# Altium schematic sheet STM32H730_PINOUT.SchDoc
size D; SheetNumber: 5; SheetTotal: 6
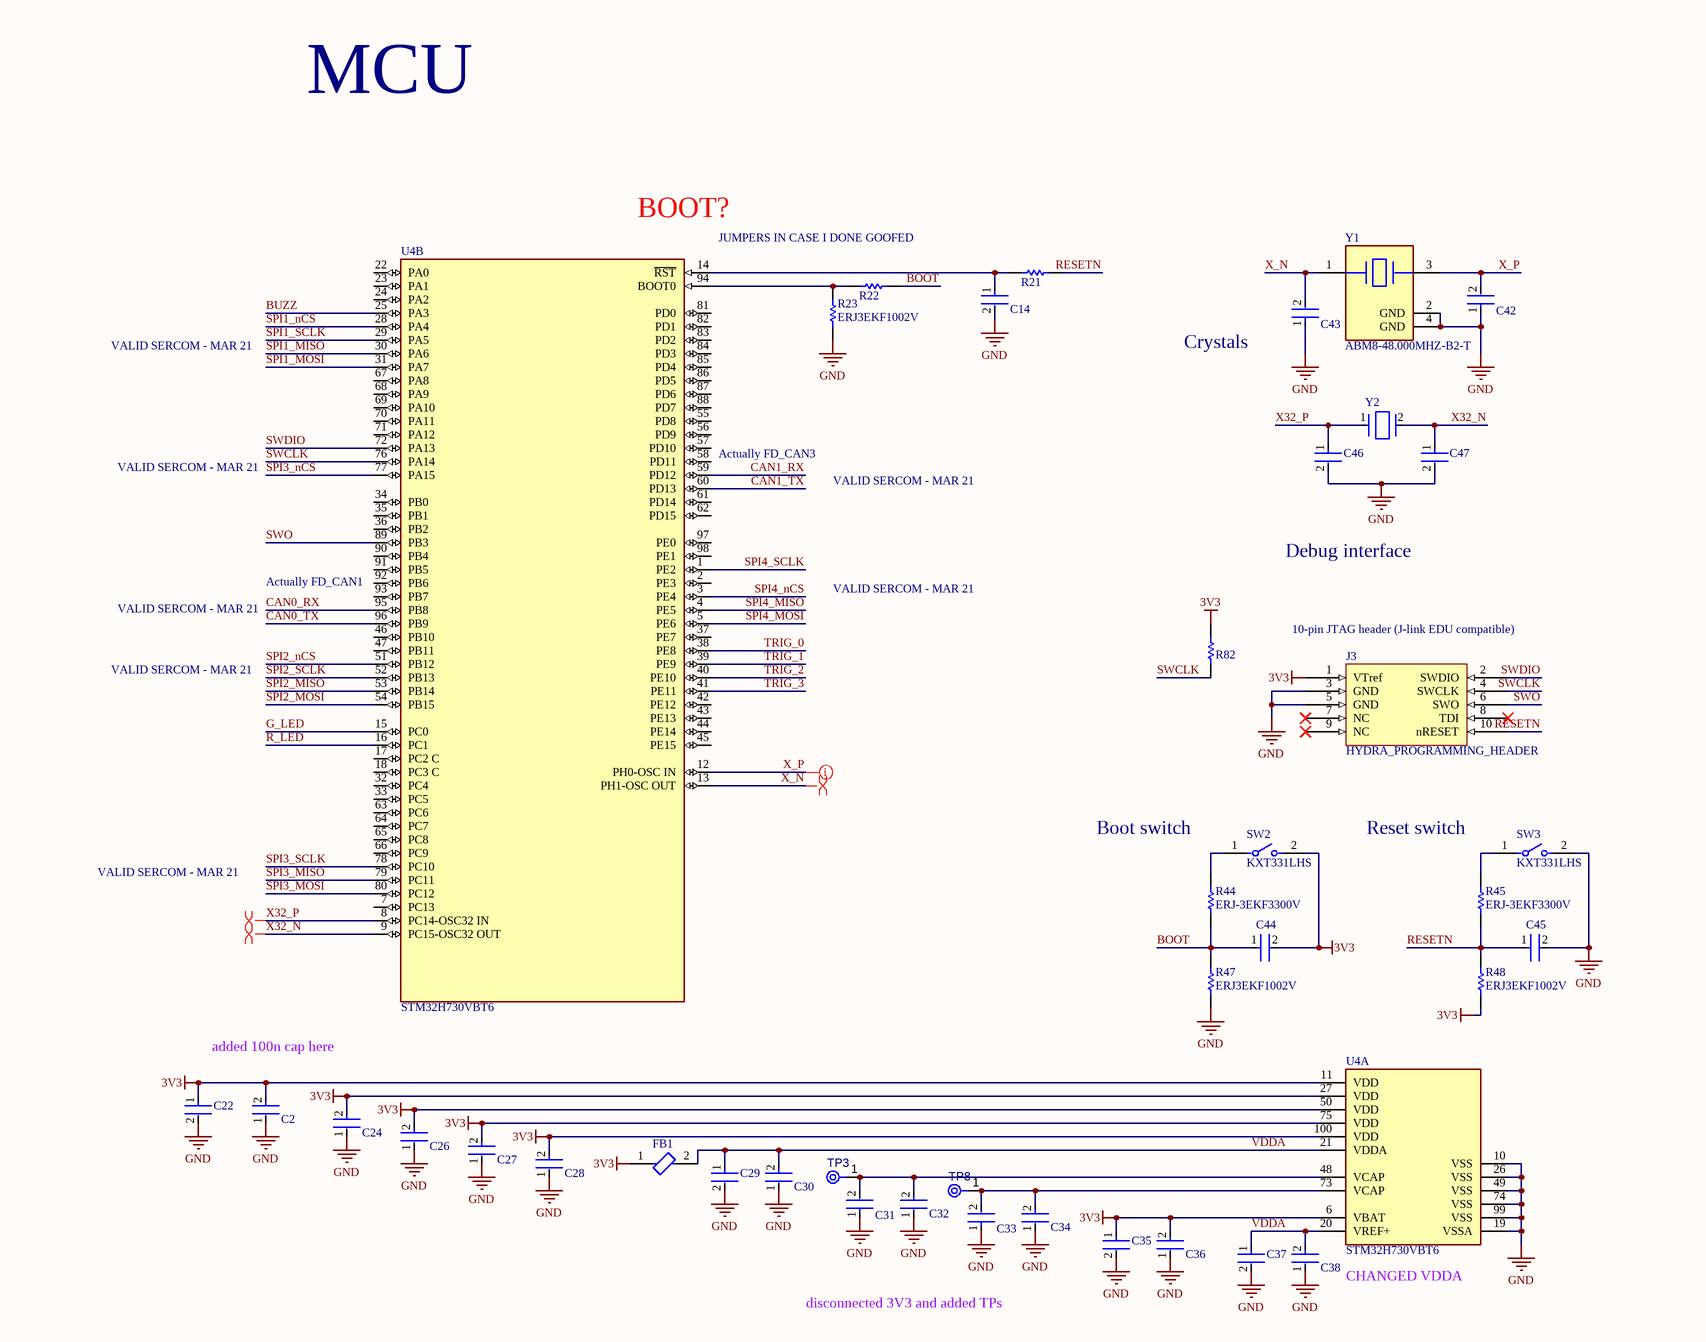
[diagram p0: STM32H730_PINOUT.SchDoc, top left]
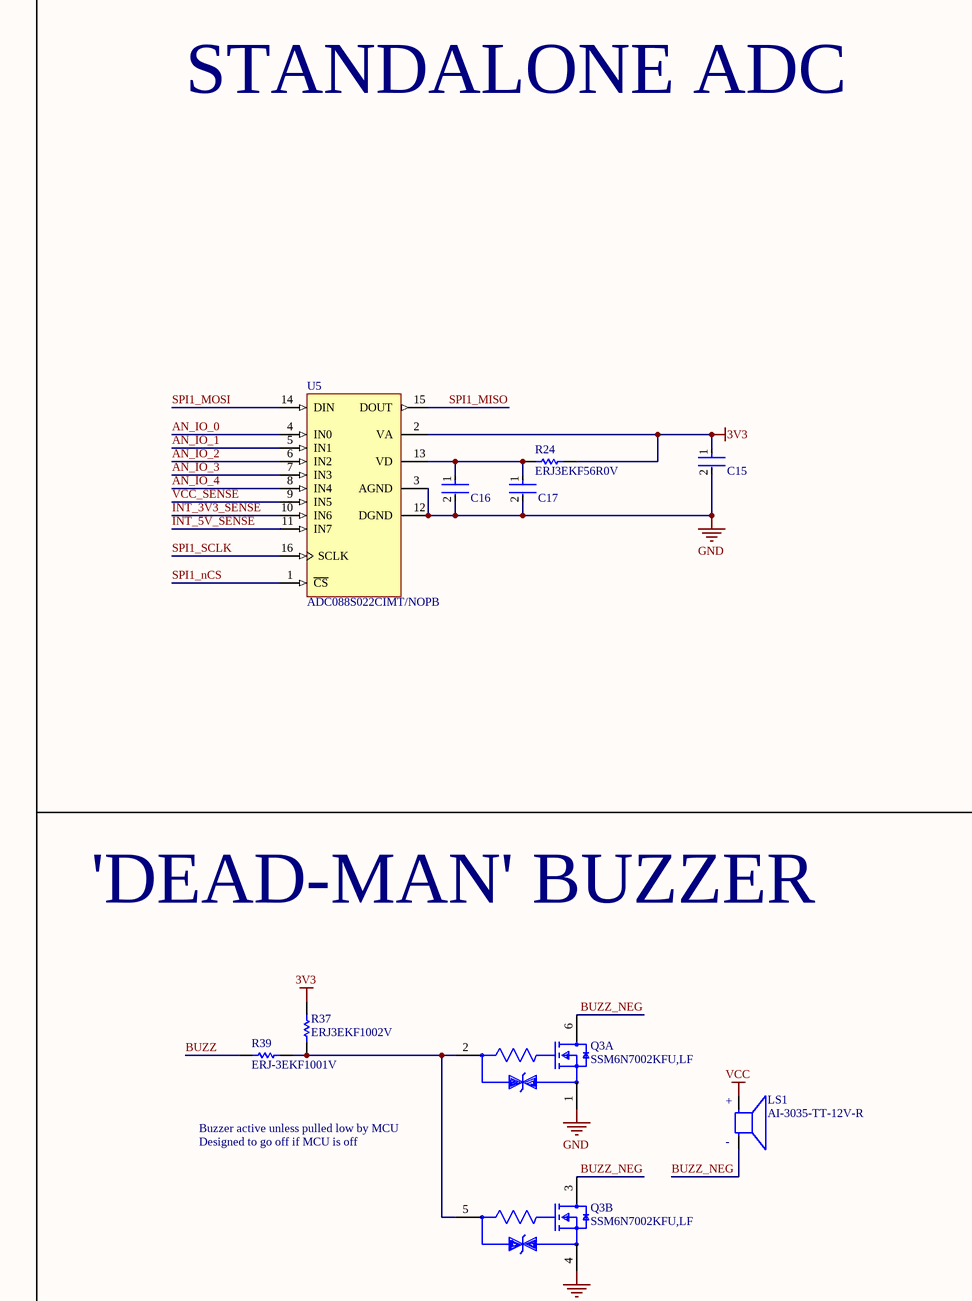
[diagram p1: STM32H730_PINOUT.SchDoc, top middle]
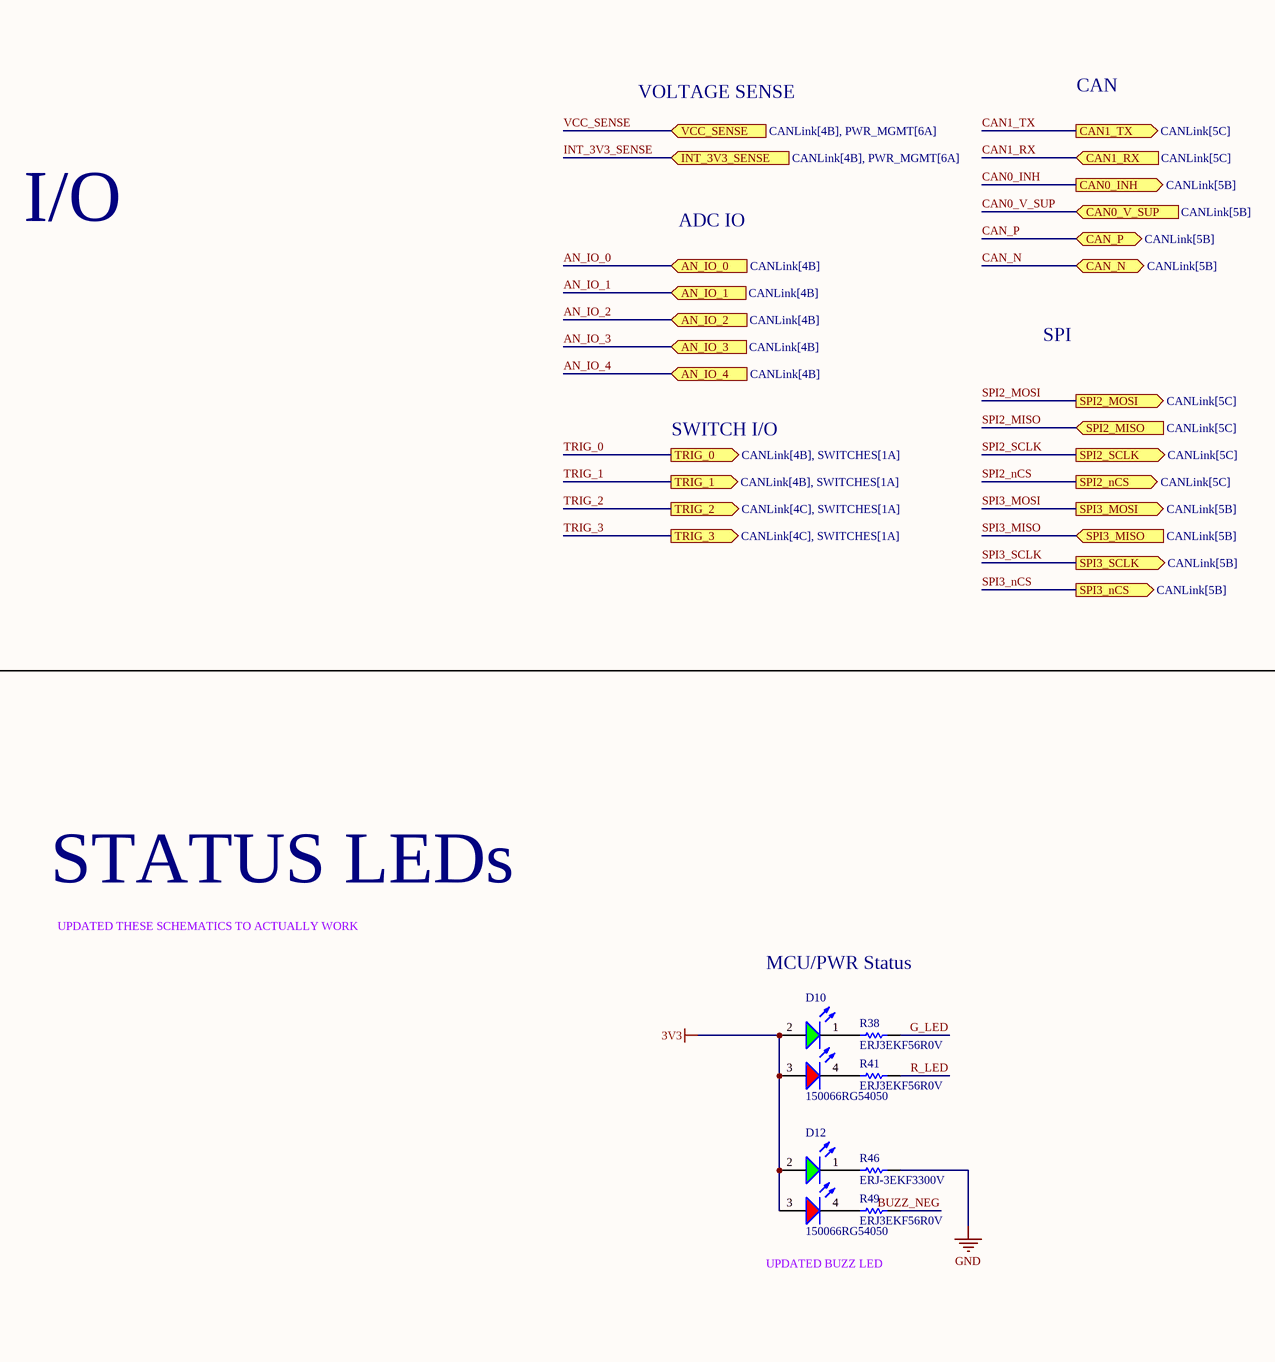
[diagram p2: STM32H730_PINOUT.SchDoc, top right]
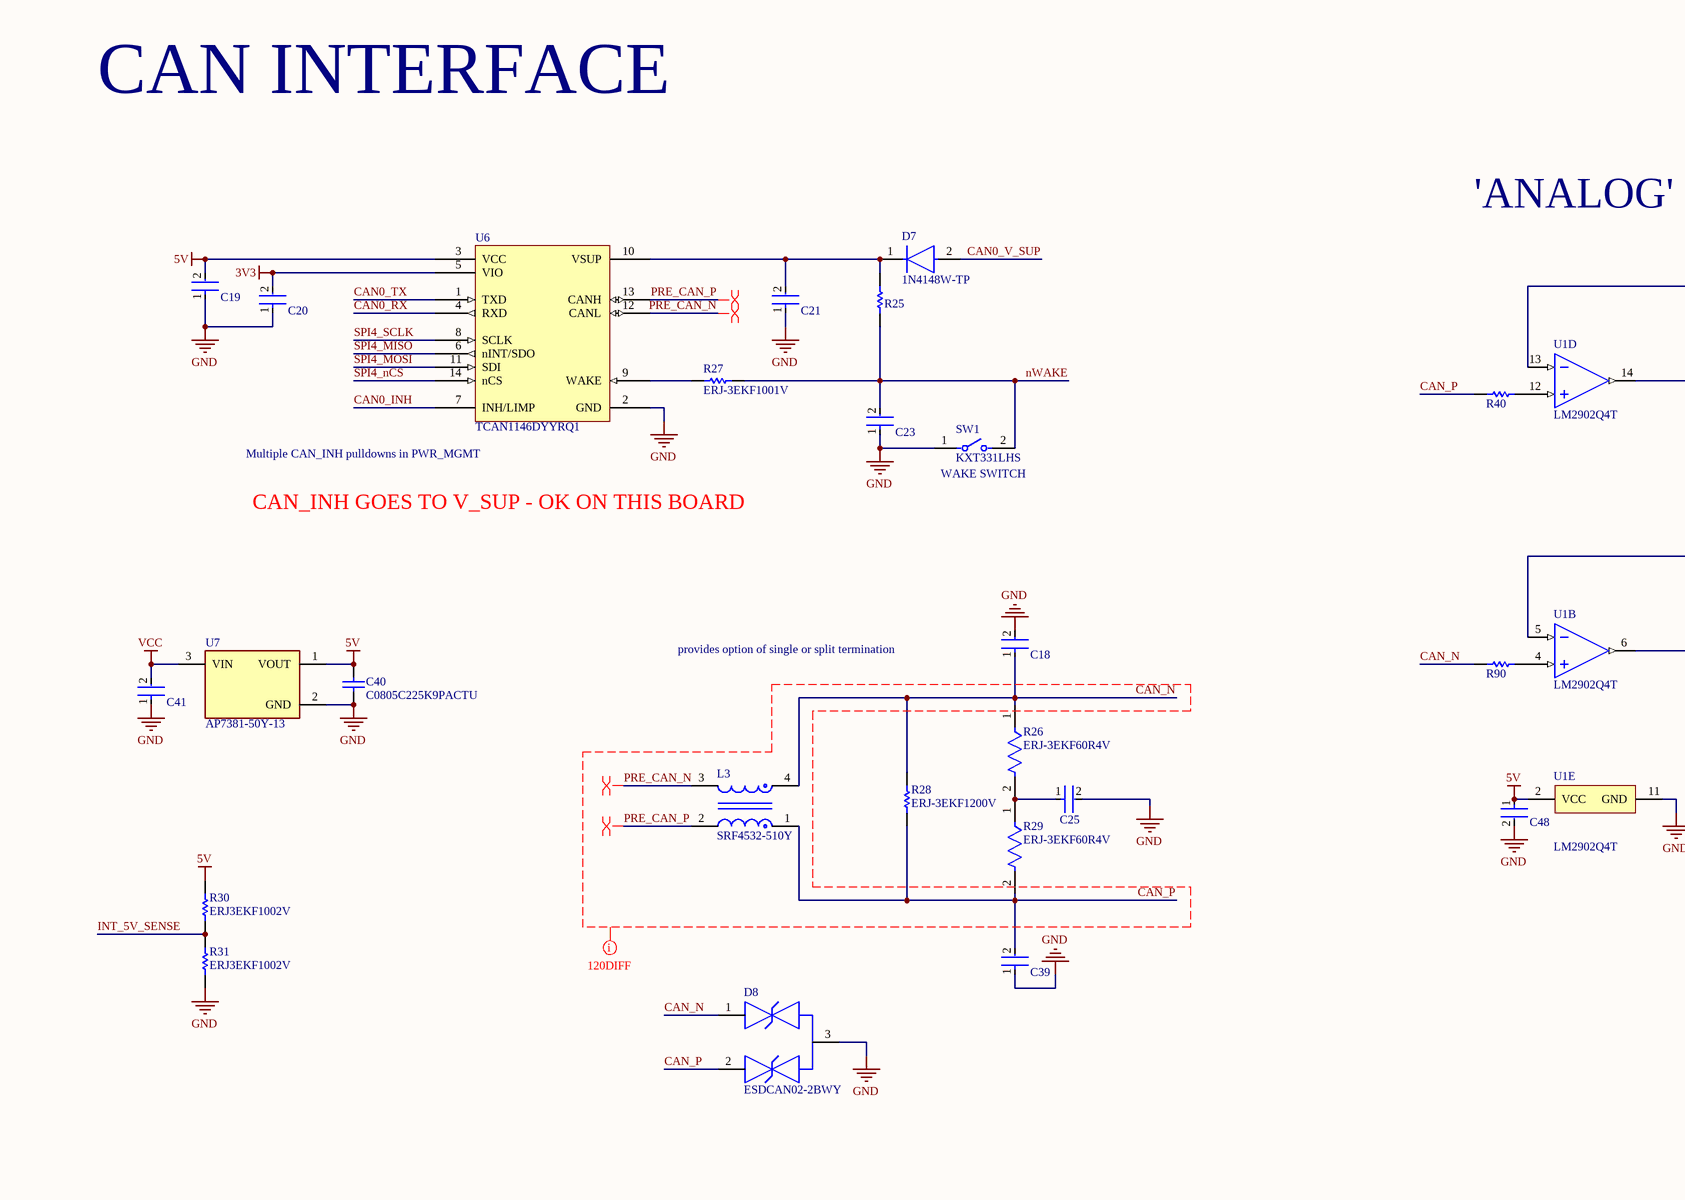
[diagram p3: STM32H730_PINOUT.SchDoc, bottom left]
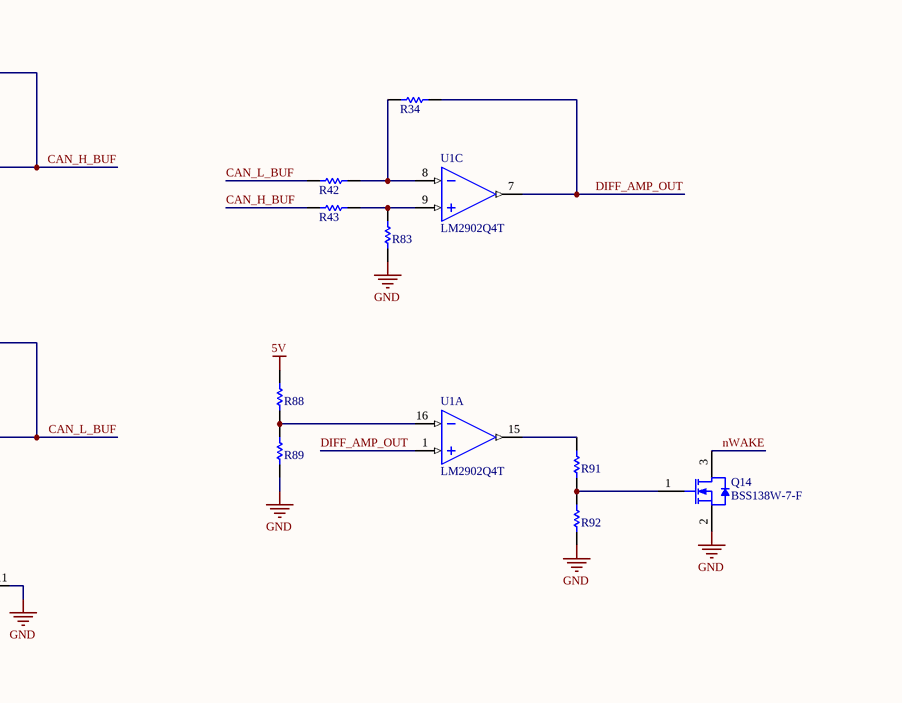
[diagram p4: STM32H730_PINOUT.SchDoc, bottom middle]
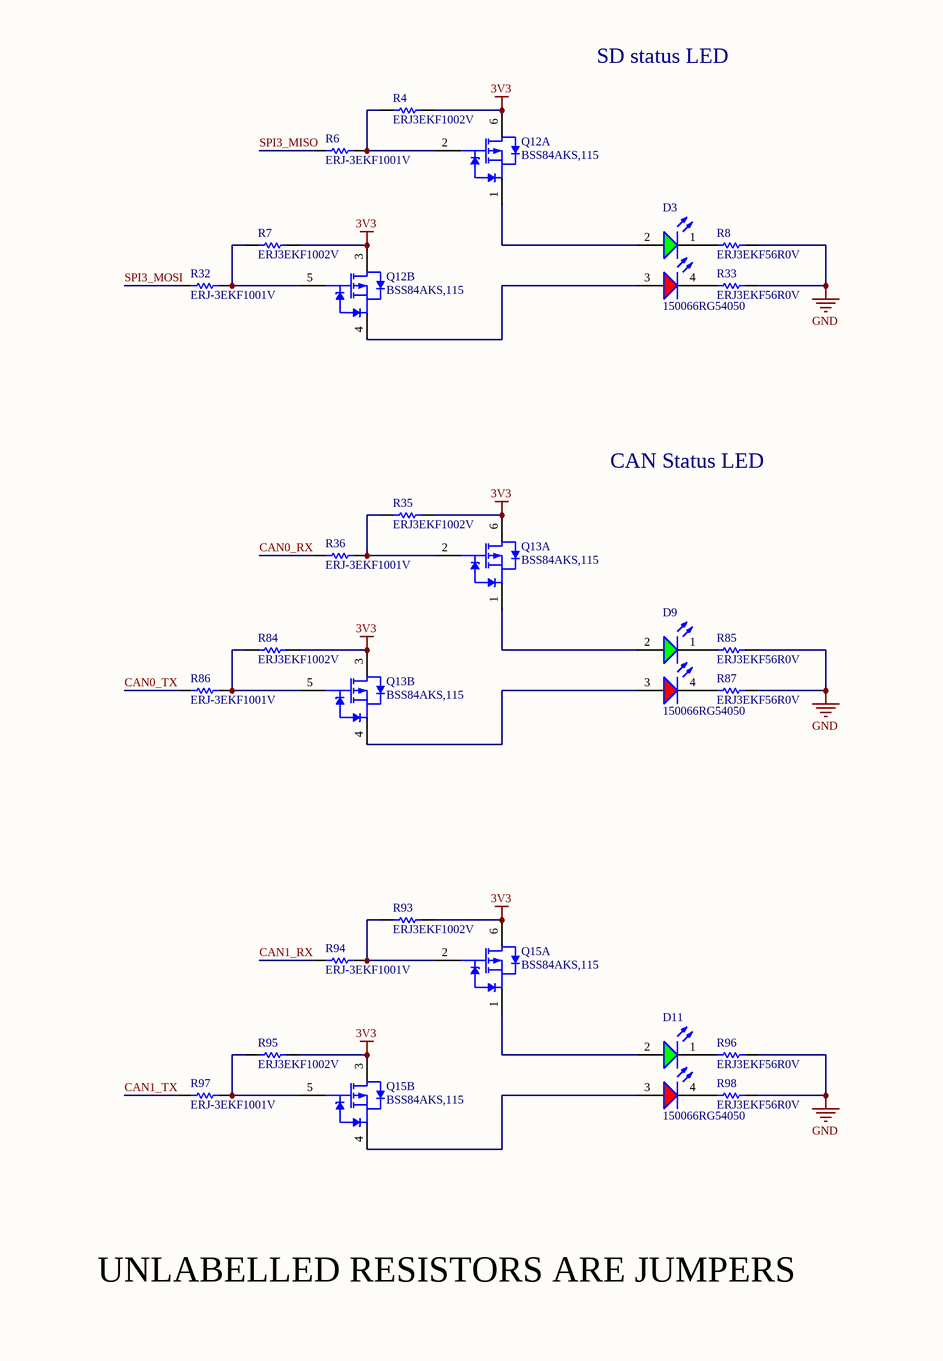
[diagram p5: STM32H730_PINOUT.SchDoc, bottom right]

## Parts
C2  GRM155R71C104KA88D  [FP-GRM15-MFG]  (value not drawn)
C14  C0402C104K8PACTU  [FP-C0402-BB-MFG]  (value not drawn)
C15  C0402C104K8PACTU  [FP-C0402-BB-MFG]  (value not drawn)
C16  C0402C104K8PACTU  [FP-C0402-BB-MFG]  (value not drawn)
C17  C0402C104K8PACTU  [FP-C0402-BB-MFG]  (value not drawn)
C18  C0402C104K8PACTU  [FP-C0402-BB-MFG]  (value not drawn)
C19  C0402C104K8PACTU  [FP-C0402-BB-MFG]  (value not drawn)
C20  C0402C104K8PACTU  [FP-C0402-BB-MFG]  (value not drawn)
C21  C0402C104K8PACTU  [FP-C0402-BB-MFG]  (value not drawn)
C22  C1005X5R1A475K050BC  [FP-C1005-050-0_15-MFG]  (value not drawn)
C23  C0402C104K8PACTU  [FP-C0402-BB-MFG]  (value not drawn)
C24  GRM155R71C104KA88D  [FP-GRM15-MFG]  (value not drawn)
C25  C0402C104K8PACTU  [FP-C0402-BB-MFG]  (value not drawn)
C26  GRM155R71C104KA88D  [FP-GRM15-MFG]  (value not drawn)
C27  GRM155R71C104KA88D  [FP-GRM15-MFG]  (value not drawn)
C28  GRM155R71C104KA88D  [FP-GRM15-MFG]  (value not drawn)
C29  EMK105BJ105KV-F  [FP-0402-L_1_0_0_05-W_0_5-IPC_A]  (value not drawn)
C30  GRM155R71C104KA88D  [FP-GRM15-MFG]  (value not drawn)
C31  C1005X7S1A225K050BC  [FP-C1005-050-0_15-0_1-MFG]  (value not drawn)
C32  GRM155R71C104KA88D  [FP-GRM15-MFG]  (value not drawn)
C33  C1005X7S1A225K050BC  [FP-C1005-050-0_15-0_1-MFG]  (value not drawn)
C34  GRM155R71C104KA88D  [FP-GRM15-MFG]  (value not drawn)
C35  EMK105BJ105KV-F  [FP-0402-L_1_0_0_05-W_0_5-IPC_A]  (value not drawn)
C36  GRM155R71C104KA88D  [FP-GRM15-MFG]  (value not drawn)
C37  EMK105BJ105KV-F  [FP-0402-L_1_0_0_05-W_0_5-IPC_A]  (value not drawn)
C38  GRM155R71C104KA88D  [FP-GRM15-MFG]  (value not drawn)
C39  C0402C104K8PACTU  [FP-C0402-BB-MFG]  (value not drawn)
C40  C0805C225K9PACTU  [CAPC2013X145X50ML20T25]
C41  C0402C104K8PACTU  [FP-C0402-BB-MFG]  (value not drawn)
C42  08051A6R8CAT2A  [FP-0805-L_2_01_0_2-W_1_25-MFG]  (value not drawn)
C43  08051A6R8CAT2A  [FP-0805-L_2_01_0_2-W_1_25-MFG]  (value not drawn)
C44  C0402C104K8PACTU  [FP-C0402-BB-MFG]  (value not drawn)
C45  C0402C104K8PACTU  [FP-C0402-BB-MFG]  (value not drawn)
C46  C0805C180J5GACTU  [FP-C0805C-DN-MFG]  (value not drawn)
C47  C0805C180J5GACTU  [FP-C0805C-DN-MFG]  (value not drawn)
C48  C0402C104K8PACTU  [FP-C0402-BB-MFG]  (value not drawn)
D3  150066RG54050  [WL-SBCD_0606]
D7  1N4148W-TP  [FP-SOD-123-IPC_A]
D8  ESDCAN02-2BWY  [FP-SOT323-3L-MFG]
D9  150066RG54050  [WL-SBCD_0606]
D10  150066RG54050  [WL-SBCD_0606]
D11  150066RG54050  [WL-SBCD_0606]
D12  150066RG54050  [WL-SBCD_0606]
FB1  BLM15PX601SN1D  [FP-BLM15-0_05-MFG]  (value not drawn)
J3  HYDRA_PROGRAMMING_HEADER  [3220-10-0300-00-Footprint-1]
L3  SRF4532-510Y  [FP-SRF4532-MFG]
LS1  AI-3035-TT-12V-R  [AI-3035-TT-12V-R-Footprint-1]
Q3  SSM6N7002KFU,LF  [FP-SSOP6-P-0_65A-MFG]  (parts A,B of 2)
Q12  BSS84AKS,115  [NXP-SOT363_L]  (parts A,B of 2)
Q13  BSS84AKS,115  [NXP-SOT363_L]  (parts A,B of 2)
Q14  BSS138W-7-F  [DIOD-SOT323-3_V]
Q15  BSS84AKS,115  [NXP-SOT363_L]  (parts A,B of 2)
R4  ERJ3EKF1002V  [RESC1609X55X30LL15T15]
R6  ERJ-3EKF1001V  [RESC1608X55X30LL15T15]
R7  ERJ3EKF1002V  [RESC1609X55X30LL15T15]
R8  ERJ3EKF56R0V  [RESC1608X55X30NL15T15]
R21  0402 JUMPER 0 OHM  [RESC1005X40X25NL05T05]  (value not drawn)
R22  0402 JUMPER 0 OHM  [RESC1005X40X25NL05T05]  (value not drawn)
R23  ERJ3EKF1002V  [RESC1609X55X30LL15T15]
R24  ERJ3EKF56R0V  [RESC1608X55X30NL15T15]
R25  ERJ3EKF1002V  [RESC1609X55X30LL15T15]  (value not drawn)
R26  ERJ-3EKF60R4V  [FP-ERJ3EK-IPC_C]
R27  ERJ-3EKF1001V  [RESC1608X55X30LL15T15]
R28  ERJ-3EKF1200V  [RESC1609X55X30ML15T15]
R29  ERJ-3EKF60R4V  [FP-ERJ3EK-IPC_C]
R30  ERJ3EKF1002V  [RESC1609X55X30LL15T15]
R31  ERJ3EKF1002V  [RESC1609X55X30LL15T15]
R32  ERJ-3EKF1001V  [RESC1608X55X30LL15T15]
R33  ERJ3EKF56R0V  [RESC1608X55X30NL15T15]
R34  ERJ3EKF1002V  [RESC1609X55X30LL15T15]  (value not drawn)
R35  ERJ3EKF1002V  [RESC1609X55X30LL15T15]
R36  ERJ-3EKF1001V  [RESC1608X55X30LL15T15]
R37  ERJ3EKF1002V  [RESC1609X55X30LL15T15]
R38  ERJ3EKF56R0V  [RESC1608X55X30NL15T15]
R39  ERJ-3EKF1001V  [RESC1608X55X30LL15T15]
R40  ERJ3EKF1002V  [RESC1609X55X30LL15T15]  (value not drawn)
R41  ERJ3EKF56R0V  [RESC1608X55X30NL15T15]
R42  ERJ3EKF1002V  [RESC1609X55X30LL15T15]  (value not drawn)
R43  ERJ3EKF1002V  [RESC1609X55X30LL15T15]  (value not drawn)
R44  ERJ-3EKF3300V  [RESC1608X55X30LL15T15]
R45  ERJ-3EKF3300V  [RESC1608X55X30LL15T15]
R46  ERJ-3EKF3300V  [RESC1608X55X30LL15T15]
R47  ERJ3EKF1002V  [RESC1609X55X30LL15T15]
R48  ERJ3EKF1002V  [RESC1609X55X30LL15T15]
R49  ERJ3EKF56R0V  [RESC1608X55X30NL15T15]
R82  ERJ3EKF1002V  [RESC1609X55X30LL15T15]  (value not drawn)
R83  ERJ3EKF1002V  [RESC1609X55X30LL15T15]  (value not drawn)
R84  ERJ3EKF1002V  [RESC1609X55X30LL15T15]
R85  ERJ3EKF56R0V  [RESC1608X55X30NL15T15]
R86  ERJ-3EKF1001V  [RESC1608X55X30LL15T15]
R87  ERJ3EKF56R0V  [RESC1608X55X30NL15T15]
R88  ERJ3EKF1002V  [RESC1609X55X30LL15T15]  (value not drawn)
R89  ERJ-3EKF1001V  [RESC1608X55X30LL15T15]  (value not drawn)
R90  ERJ3EKF1002V  [RESC1609X55X30LL15T15]  (value not drawn)
R91  ERJ3EKF1002V  [RESC1609X55X30LL15T15]  (value not drawn)
R92  ERJ3EKF1002V  [RESC1609X55X30LL15T15]  (value not drawn)
R93  ERJ3EKF1002V  [RESC1609X55X30LL15T15]
R94  ERJ-3EKF1001V  [RESC1608X55X30LL15T15]
R95  ERJ3EKF1002V  [RESC1609X55X30LL15T15]
R96  ERJ3EKF56R0V  [RESC1608X55X30NL15T15]
R97  ERJ-3EKF1001V  [RESC1608X55X30LL15T15]
R98  ERJ3EKF56R0V  [RESC1608X55X30NL15T15]
SW1  KXT331LHS  [FP-KXT331LHS-MFG]
SW2  KXT331LHS  [FP-KXT331LHS-MFG]
SW3  KXT331LHS  [FP-KXT331LHS-MFG]
TP3  TPAD6R  [TP06R]  (value not drawn)  (no BOM)
TP8  TPAD6R  [TP06R]  (value not drawn)  (no BOM)
U1  LM2902Q4T  [LM2902Q4T-Footprint-1]  (parts A,B,C,D,E of 5)
U4  STM32H730VBT6  [FP-LQFP100-1L-IPC_C]  (parts A,B of 2)
U5  ADC088S022CIMT/NOPB  [MTC16_L]
U6  TCAN1146DYYRQ1  [TCAN1146DYYRQ1-Footprint-1]
U7  AP7381-50Y-13  [FP-SOT89-MFG]
Y1  ABM8-48.000MHZ-B2-T  [FP-ABM8-MFG]
Y2  ECS-.327-12.5-1210-TR  [FP-ECX-1210-MFG]  (value not drawn)

## Ports
AN_IO_0 (in, see CANLink[4B]), AN_IO_1 (in, see CANLink[4B]), AN_IO_2 (in, see CANLink[4B]), AN_IO_3 (in, see CANLink[4B]), AN_IO_4 (in, see CANLink[4B]), CAN0_INH (out, see CANLink[5B]), CAN0_V_SUP (in, see CANLink[5B]), CAN1_RX (in, see CANLink[5C]), CAN1_TX (out, see CANLink[5C]), CAN_N (bidir, see CANLink[5B]), CAN_P (bidir, see CANLink[5B]), INT_3V3_SENSE (in, see CANLink[4B], PWR_MGMT[6A]), SPI2_MISO (in, see CANLink[5C]), SPI2_MOSI (out, see CANLink[5C]), SPI2_nCS (out, see CANLink[5C]), SPI2_SCLK (out, see CANLink[5C]), SPI3_MISO (in, see CANLink[5B]), SPI3_MOSI (out, see CANLink[5B]), SPI3_nCS (out, see CANLink[5B]), SPI3_SCLK (out, see CANLink[5B]), TRIG_0 (out, see CANLink[4B], SWITCHES[1A]), TRIG_1 (out, see CANLink[4B], SWITCHES[1A]), TRIG_2 (out, see CANLink[4C], SWITCHES[1A]), TRIG_3 (out, see CANLink[4C], SWITCHES[1A]), VCC_SENSE (in, see CANLink[4B], PWR_MGMT[6A])

## Nets
3V3: C2.2 C15.1 C20.2 C22.1 C24.2 C26.2 C27.2 C28.2 C35.1 C36.2 C44.2 D10.2(A) D10.3(A) D12.2(A) D12.3(A) FB1.1 J3.1(VTref) Q12.3(D2) Q12.6(D1) Q13.3(D2) Q13.6(D1) Q15.3(D2) Q15.6(D1) R4.2 R7.2 R24.1 R35.2 R37.2 R48.1 R82.1 R84.2 R93.2 R95.2 SW2.2 U4.6(VBAT) U4.11(VDD) U4.27(VDD) U4.50(VDD) U4.75(VDD) U4.100(VDD) U5.2(VA) U6.5(VIO)
5V: C19.2 C40.2 C48.1 R30.2 R88.2 U1.2(VCC) U6.3(VCC) U7.1(VOUT)
GND: C2.1 C14.2 C15.2 C16.2 C17.2 C18.2 C19.1 C20.1 C21.1 C22.2 C23.1 C24.1 C25.2 C26.1 C27.1 C28.1 C29.2 C30.1 C31.1 C32.1 C33.1 C34.1 C35.2 C36.1 C37.2 C38.1 C39.1 C40.1 C41.1 C42.1 C43.1 C45.2 C46.2 C47.2 C48.2 D8.3 J3.3(GND) J3.5(GND) Q3.1(Source1) Q3.4(Source2) Q14.2(S) R8.1 R23.1 R31.2 R33.1 R46.2 R47.1 R83.2 R85.1 R87.1 R89.1 R92.1 R96.1 R98.1 SW1.1 SW3.2 U1.11(GND) U4.10(VSS) U4.19(VSSA) U4.26(VSS) U4.49(VSS) U4.74(VSS) U4.99(VSS) U5.3(AGND) U5.12(DGND) U6.2(GND) U7.2(GND) Y1.2(GND) Y1.4(GND)
VCC: C41.2 LS1.P U7.3(VIN)
AN_IO_0: U5.4(IN0) ; port AN_IO_0
AN_IO_1: U5.5(IN1) ; port AN_IO_1
AN_IO_2: U5.6(IN2) ; port AN_IO_2
AN_IO_3: U5.7(IN3) ; port AN_IO_3
AN_IO_4: U5.8(IN4) ; port AN_IO_4
BOOT: C44.1 R22.2 R44.1 R47.2
BUZZ: R39.1 U4.25(PA3)
BUZZ_NEG: LS1.N Q3.3(Drain2) Q3.6(Drain1) R49.1
CAN0_INH: U6.7(INH/LIMP) ; port CAN0_INH
CAN0_RX: R36.1 U4.95(PB8) U6.4(RXD)
CAN0_TX: R86.1 U4.96(PB9) U6.1(TXD)
CAN0_V_SUP: D7.2(A) ; port CAN0_V_SUP
CAN1_RX: R94.1 U4.59(PD12) ; port CAN1_RX
CAN1_TX: R97.1 U4.60(PD13) ; port CAN1_TX
CAN_H_BUF: R43.1 U1.13(4IN-) U1.14(4OUT)
CAN_L_BUF: R42.1 U1.5(2IN-) U1.6(2OUT)
CAN_N: C18.1 D8.1 L3.4 R26.1 R28.1 R90.1 ; port CAN_N
CAN_P: C39.2 D8.2 L3.1 R28.2 R29.2 R40.1 ; port CAN_P
DIFF_AMP_OUT: R34.2 U1.1(1IN+) U1.7(3OUT)
G_LED: R38.1 U4.15(PC0)
INT_3V3_SENSE: U5.10(IN6) ; port INT_3V3_SENSE
INT_5V_SENSE: R30.1 R31.1 U5.11(IN7)
nWAKE: C23.2 Q14.3(D) R25.2 R27.2 SW1.2
PRE_CAN_N: L3.3 U6.12(CANL)
PRE_CAN_P: L3.2 U6.13(CANH)
R_LED: R41.1 U4.16(PC1)
RESETN: C45.1 J3.10(nRESET) R21.2 R45.1 R48.2
SPI1_MISO: U4.30(PA6) U5.15(DOUT)
SPI1_MOSI: U4.31(PA7) U5.14(DIN)
SPI1_nCS: U4.28(PA4) U5.1(~{CS})
SPI1_SCLK: U4.29(PA5) U5.16(SCLK)
SPI2_MISO: U4.53(PB14) ; port SPI2_MISO
SPI2_MOSI: U4.54(PB15) ; port SPI2_MOSI
SPI2_nCS: U4.51(PB12) ; port SPI2_nCS
SPI2_SCLK: U4.52(PB13) ; port SPI2_SCLK
SPI3_MISO: R6.1 U4.79(PC11) ; port SPI3_MISO
SPI3_MOSI: R32.1 U4.80(PC12) ; port SPI3_MOSI
SPI3_nCS: U4.77(PA15) ; port SPI3_nCS
SPI3_SCLK: U4.78(PC10) ; port SPI3_SCLK
SPI4_MISO: U4.4(PE5) U6.6(nINT/SDO)
SPI4_MOSI: U4.5(PE6) U6.11(SDI)
SPI4_nCS: U4.3(PE4) U6.14(nCS)
SPI4_SCLK: U4.1(PE2) U6.8(SCLK)
SWCLK: J3.4(SWCLK) R82.2 U4.76(PA14)
SWDIO: J3.2(SWDIO) U4.72(PA13)
SWO: J3.6(SWO) U4.89(PB3)
TRIG_0: U4.38(PE8) ; port TRIG_0
TRIG_1: U4.39(PE9) ; port TRIG_1
TRIG_2: U4.40(PE10) ; port TRIG_2
TRIG_3: U4.41(PE11) ; port TRIG_3
VCC_SENSE: U5.9(IN5) ; port VCC_SENSE
VDDA: C29.1 C30.2 C37.1 C38.2 FB1.2 U4.20(VREF+) U4.21(VDDA)
X32_N: C47.1 U4.9(PC15-OSC32_OUT) Y2.2(Out/In)
X32_P: C46.1 U4.8(PC14-OSC32_IN) Y2.1(In/Out)
X_N: C43.2 U4.13(PH1-OSC_OUT) Y1.1
X_P: C42.2 U4.12(PH0-OSC_IN) Y1.3
NetC14_1: C14.1 R21.1 U4.14(~{RST})
NetC16_1: C16.1 C17.1 R24.2 U5.13(VD)
NetC21_2: C21.2 D7.1(C) R25.1 U6.10(VSUP)
NetC25_1: C25.1 R26.2 R29.1
NetC31_2: C31.2 C32.2 TP3.1(TP) U4.48(VCAP)
NetC33_2: C33.2 C34.2 TP8.1(TP) U4.73(VCAP)
NetD3_1: D3.1(K) R8.2
NetD3_2: D3.2(A) Q12.1(S1)
NetD3_3: D3.3(A) Q12.4(S2)
NetD3_4: D3.4(K) R33.2
NetD9_1: D9.1(K) R85.2
NetD9_2: D9.2(A) Q13.1(S1)
NetD9_3: D9.3(A) Q13.4(S2)
NetD9_4: D9.4(K) R87.2
NetD10_1: D10.1(K) R38.2
NetD10_4: D10.4(K) R41.2
NetD11_1: D11.1(K) R96.2
NetD11_2: D11.2(A) Q15.1(S1)
NetD11_3: D11.3(A) Q15.4(S2)
NetD11_4: D11.4(K) R98.2
NetD12_1: D12.1(K) R46.1
NetD12_4: D12.4(K) R49.2
NetQ3_2: Q3.2(Gate1) Q3.5(Gate2) R37.1 R39.2
NetQ12_2: Q12.2(G1) R4.1 R6.2
NetQ12_5: Q12.5(G2) R7.1 R32.2
NetQ13_2: Q13.2(G1) R35.1 R36.2
NetQ13_5: Q13.5(G2) R84.1 R86.2
NetQ14_1: Q14.1(G) R91.1 R92.2
NetQ15_2: Q15.2(G1) R93.1 R94.2
NetQ15_5: Q15.5(G2) R95.1 R97.2
NetR22_1: R22.1 R23.2 U4.94(BOOT0)
NetR27_1: R27.1 U6.9(WAKE)
NetR34_1: R34.1 R42.2 U1.8(3IN-)
NetR40_2: R40.2 U1.12(4IN+)
NetR43_2: R43.2 R83.1 U1.9(3IN+)
NetR44_2: R44.2 SW2.1
NetR45_2: R45.2 SW3.1
NetR88_1: R88.1 R89.2 U1.16(1IN-)
NetR90_2: R90.2 U1.4(2IN+)
NetR91_2: R91.2 U1.15(1OUT)

Not connected (* = marked no-connect by the designer): J3 7(NC)* 8(TDI)* 9(NC)*; U4 2(PE3) 7(PC13) 17(PC2_C) 18(PC3_C) 22(PA0) 23(PA1) 24(PA2) 32(PC4) 33(PC5) 34(PB0) 35(PB1) 36(PB2) 37(PE7) 42(PE12) 43(PE13) 44(PE14) 45(PE15) 46(PB10) 47(PB11) 55(PD8) 56(PD9) 57(PD10) 58(PD11) 61(PD14) 62(PD15) 63(PC6) 64(PC7) 65(PC8) 66(PC9) 67(PA8) 68(PA9) 69(PA10) 70(PA11) 71(PA12) 81(PD0) 82(PD1) 83(PD2) 84(PD3) 85(PD4) 86(PD5) 87(PD6) 88(PD7) 90(PB4) 91(PB5) 92(PB6) 93(PB7) 97(PE0) 98(PE1)

## Layout directives
differential pair: PRE_CAN_N, PRE_CAN_P, X32_N, X32_P, X_N, X_P
net class 120DIFF: CAN_N, CAN_P, PRE_CAN_N, PRE_CAN_P

## Notes on the sheet
- VOLTAGE SENSE
- CAN
- MCU
- STANDALONE ADC
- I/O
- ADC IO
- (near U4) BOOT?
- SPI
- JUMPERS IN CASE I DONE GOOFED
- VALID SERCOM - MAR 21
- (near C43) Crystals
- SWITCH I/O
- (near U4) Actually FD_CAN3
- Debug interface
- (near U4) Actually FD_CAN1
- (near J3) 10-pin JTAG header (J-link EDU compatible)
- STATUS LEDs
- Boot switch
- Reset switch
- UPDATED THESE SCHEMATICS TO ACTUALLY WORK
- MCU/PWR Status
- 'DEAD-MAN' BUZZER
- added 100n cap here
- Buzzer active unless pulled low by MCU
- Designed to go off if MCU is off
- UPDATED BUZZ LED
- disconnected 3V3 and added TPs
- CHANGED VDDA
- SD status LED
- CAN INTERFACE
- 'ANALOG' CAN SIGNAL DETECTOR
- CAN Status LED
- (near U6) Multiple CAN_INH pulldowns in PWR_MGMT
- (near SW1) WAKE SWITCH
- CAN_INH GOES TO V_SUP - OK ON THIS BOARD
- provides option of single or split termination
- UNLABELLED RESISTORS ARE JUMPERS
- (in symbol CMP-00027-00003-1) +; -

## Library data of the parts
C2 C24 C26-C28 C30 C32 C34 C36 C38 = CMP-2100-03641-2: CAP CER 0.1UF 16V X7R 0402; Manufacturer: Murata; Standoff Height: 0mm; Tolerance: 10%; Voltage Rating: 16Vdc; Material: Ceramic; Capacitance: 0.10μF; Value: 0.10μF; RoHS: TRUE; Manufacturer Part Number: GRM155R71C104KA88D; Temperature Characteristic: X7R; Octopart: https://octopart.com/grm155r71c104ka88d-murata-196880; Digikey Description: CAP CER 0.1UF 16V X7R 0402; Device Class L3: Ceramic Capacitors; Height: 0.55mm; ComponentLink2Description: Datasheet; Temperature Range Low: -55°C; Ipc Land Pattern Name: CAPC10050X219; ComponentLink2URL: https://search.murata.co.jp/Ceramy/image/img/A01X/G101/ENG/GRM155R71H471KA01-01A.pdf; Device Class L1: Passive Components; Lead Free: yes; Category: Cap; Package: GRM15; Temperature: -55°C to +125°C; Device Class L2: Capacitors; Temperature Range High: +125°C; Mouser Description: 0402 0.1 uF 16V ±10 % Tolerance X7R SMT Multilayer Ceramic Capacitor
C14-C21 C23 C25 C39 C41 C44 C45 C48 = CMP-2008-02046-2: CAP CER 0.1UF 10V X5R 0402; Manufacturer: Kemet; Material: Ceramic; Capacitance: 0.10 μF; Temperature Coefficient: 15%; Tolerance: 0.1; Value: 0.10 μF; Package: C0402-BB; Temperature: -55°C to +125°C; ComponentLink2Description: Datasheet; Temperature Characteristic: X5R; Device Class L1: Passive Components; Height: 0.55mm; Lead Free: Yes; ComponentLink2URL: https://content.kemet.com/datasheets/KEM_C1002_X7R_SMD.pdf; Device Class L2: Capacitors; Temperature Range Low: -55°C; Temperature Range High: +125°C; RoHS: TRUE; Octopart: https://octopart.com/c0402c104k8pactu-kemet-140039; Automotive: No; Mouser Description: Capacitor 100 nF 10 VDC 0402; Category: Cap; Voltage Rating: 10 V; Digikey Description: CAP CER 0.1UF 10V X5R 0402; Ipc Land Pattern Name: CAPC10050X50; Device Class L3: Ceramic Capacitors; Manufacturer Part Number: C0402C104K8PACTU
C22 = CMP-2000-05997-2: CAP CER 4.7UF 10V X5R 0402; Dielectric Material: Ceramic; Tolerance: 10%; Series: C; Package Quantity: 10000; Max Operating Temperature: 85°C; Case Code (Imperial): 0402; Lead Free: Lead Free; Voltage Rating (DC): 10V; Packaging: Cut Tape; Voltage Rating: 10V; Min Operating Temperature: -55°C; Dielectric: X5R; Thickness: 0.022inch; Width: 0.02inch; Case/Package: 0402; Case Code (Metric): 1005; Capacitance: 4.7uF; Length: 0.039inch; RoHS Compliant: Yes; REACH SVHC: No SVHC; Mount: Surface Mount
C29 C35 C37 = CMP-14477-000104-2: None; Tolerance: 10%; Voltage Rating: 16V; Dielectric: X5R; Capacitance: 1uF; Packaging: Tape and Reel; Depth: 0.5mm; Mount: Surface Mount; Thickness: 0.022inch; Package Quantity: 1; Min Operating Temperature: -55°C; Series: M; Voltage Rating (DC): 16V; Termination: SMD/SMT; Case/Package: 0402; Number of Pins: 2; Case Code (Imperial): 0402; Length: 1mm; Halogen Free: Halogen Free; Case Code (Metric): 1005; Width: 0.02inch; RoHS Compliant: Yes; Radiation Hardening: No; Max Operating Temperature: 85°C; Height: 0.5mm; Construction: Flat
C31 C33 = CMP-08246-004344-1: CAP CER 2.2UF 10V X7S 0402; Dielectric Material: Ceramic; Tolerance: 10%; Mount: Surface Mount; Height: 0.5mm; Package Quantity: 1; Depth: 0.5mm; RoHS Compliant: Yes; Length: 1mm; Thickness: 0.022inch; Packaging: Tape and Reel; Capacitance: 2.2uF; Case Code (Imperial): 0402; Resistor Type: Ceramic; Dielectric: X7S; Case/Package: 0402; Min Operating Temperature: -55°C; Voltage Rating: 10V; Series: C; Weight: 2.3E-05oz; Width: 0.02inch; Voltage Rating (DC): 10V; Case Code (Metric): 1005; Max Operating Temperature: 125°C; Termination: SMD/SMT; Lead Free: Lead Free
C40 = CMP-1036-04819-2: Manufacturer: Kemet; Part Number: C0805C225K9PACTU
C42 C43 = CMP-1036-00709-3: General Purpose Ceramic Capacitor, 0805, 6.8pF, 0.25pF, C0G, 30ppm/°C, 100V; Dissipation Factor: 10%; Insulation Resistance: 100GR; Tolerance: 5%; Max Operating Temperature: 125°C; RoHS Compliant: Yes; Capacitance: 6.8pF; Termination: SMD/SMT; Number of Pins: 2; Packaging: Tape and Reel; Mount: Surface Mount; Case Code (Metric): 2012; Case Code (Imperial): 0805; Height: 0.71mm; Min Operating Temperature: -55°C; Width: 0.049inch; Temperature Coefficient: 0ppm/°C; Length: 2.01mm; Dielectric: C0G; Series: -; Voltage Rating (DC): 100V; Dielectric Material: Ceramic; Depth: 1.25mm; Contact Plating: Tin; Voltage Rating: 100V; Thickness: 0.037inch; Case/Package: 0805; Lead Free: Lead Free; Radiation Hardening: No; Voltage: 100V; Construction: Flat; Package Quantity: 1; REACH SVHC: No SVHC
C46 C47 = CMP-2007-00302-2: CAP CER 18PF 50V C0G/NP0 0805; Manufacturer: KEMET; Temperature Characteristic: C0G; Tolerance: 0.05; Material: Ceramic; Temperature Coefficient: 30ppm/°C; Device Class L2: Capacitors; Capacitance: 18 pF; Temperature: -55°C to +125°C; Value: 18 pF; Package: C0805C-DN; Mouser Description: Cap Ceramic 18pF 50V C0G 5% SMD 0805 125C Paper T/R; Height: 0.88mm; ComponentLink2URL: https://content.kemet.com/datasheets/KEM_C1003_C0G_SMD.pdf; RoHS: TRUE; Octopart: https://octopart.com/c0805c180j5gactu-kemet-144810; ComponentLink2Description: Datasheet; Temperature Range High: +125°C; Digikey Description: CAP CER 18PF 50V C0G/NP0 0805; Device Class L1: Passive Components; Category: Cap; Automotive: No; Device Class L3: Ceramic Capacitors; Voltage Rating: 50 V; Temperature Range Low: -55°C; Ipc Land Pattern Name: CAPC200125X78; Lead Free: Yes; Manufacturer Part Number: C0805C180J5GACTU
D3 D9-D12 = CMP-004-00034-2: Led, Red/Grn, 180Mcd/230Mcd, 624Nm/525Nm Rohs Compliant: Yes
D7 = CMP-2000-04993-2: DIODE GEN PURP 100V 150MA SOD123; Max Reverse Leakage Current: 5uA; Max Surge Current: 2A; Reverse Recovery Time: 4ns; Polarity: Standard; Capacitance: 4pF; Max Forward Surge Current (Ifsm): 1A; Element Configuration: Single; Power Dissipation: 400mW; Forward Voltage: 1V; Radiation Hardening: No; Lead Free: Lead Free; Max Reverse Voltage (DC): 100V; Current Rating: 150mA; Forward Current: 150mA; Packaging: Tape and Reel; Number of Pins: 2; Package Quantity: 3000; Max Operating Temperature: 150°C; Min Operating Temperature: -65°C; Average Rectified Current: 150mA; Recovery Time: 4ns; Output Current: 150mA; Peak Non-Repetitive Surge Current: 2A; Width: 1.8mm; Voltage Rating (DC): 100V; Height: 1.2mm; Max Repetitive Reverse Voltage (Vrrm): 100V; Mount: Surface Mount; Length: 2.85mm
D8 = CMP-12225-000055-1: TVS DIODE 26.5V 44V SOT323-3; Manufacturer: STMicroelectronics; Value: 3pF; Direction: Bidirectional; Breakdown Voltage: 28.5V; Automotive Grade: Grade 0; Standoff Height: 0mm; Peak Pulse Power: 170W; Peak Pulse Current: 3A; Number Of Channels: 2; Max Junction Temp: +175°C; Mouser Description: TVS Diodes / ESD Suppressors Automotive dual-line Transil, Transient voltage suppressor (TVS) for CAN bus; Height: 1.1mm; Category: Diode; Reverse Standoff Voltage: 26.5V; Device Class L1: Circuit Protection; Temperature: -55°C to +175°C; RoHS: TRUE; ComponentLink2URL: https://www.st.com/resource/en/datasheet/esdcan02-2bwy.pdf; Device Class L3: unset; Device Class L2: TVS Diodes; Temperature Range High: +175°C; Octopart: https://octopart.com/esdcan02-2bwy-stmicroelectronics-58631133; Ipc Land Pattern Name: SOT65P210X95-3; Temperature Range Low: -55°C; Capacitance: 3pF; Digikey Description: TVS DIODE 26.5V 44V SOT323-3; Automotive: Yes; ComponentLink2Description: Datasheet; Clamping Voltage: 44V; Manufacturer Part Number: ESDCAN02-2BWY; Lead Free: Yes; Package: SOT323-3L
FB1 = CMP-0686-00252-4: Chip Ferrite Bead, 0402, 600Ω @ 100MHz, 0.23Ω, 25%, 900mA; Number of Circuits: 1; Impedance: 600R; DC Resistance (DCR): 230mR; Material: Steel; Length: 1mm; Package Quantity: 10000; Height: 0.5mm; Width: 0.5mm; Max DC Current: 900mA; Number of Lines: 1; Termination: SMD/SMT; Packaging: Tape and Reel; Lead Free: Lead Free; Min Operating Temperature: -55°C; Max Operating Temperature: 125°C; Max Current Rating: 900mA; Case Code (Imperial): 0402; Number of Pins: 2; Current Rating: 900mA; Test Frequency: 100MHz; Case/Package: 0402; Tolerance: 25%; Case Code (Metric): 1005
J3 = CMP-002-00075-1: CONN HEADER SMD 10POS 1.27MM (specifically compatible with J-Link EDU cable) PN: 3220-10-0300-00
L3 = CMP-07251-000006-1: CMC 51UH 200MA 2LN 2KOHM SMD; Element Configuration: Dual; Number of Lines: 2; Core Material: Ferrite; Impedance: 2kR; Test Frequency: 100kHz; Voltage Rating (DC): 50V; Insulation Resistance: 10MR; Material: Steel; Tolerance: 50%; DC Resistance (DCR): 3.5R; RoHS Compliant: Yes; Mount: Surface Mount; REACH SVHC: No SVHC; Termination: SMD/SMT; DC Current: 200mA; Current: 200mA; Lead Free: Lead Free; Contact Plating: Tin; Length: 4.5mm; Max DC Current: 200mA; Width: 0.126inch; Case/Package: 4532; Packaging: Tape and Reel; Package Quantity: 1; Min Operating Temperature: -40°C; Depth: 3.4mm; Series: SRF4532; Max Operating Temperature: 125°C; Current Rating: 200mA; Self Resonant Frequency: 100kHz; Height: 0.118inch; Inductance: 51uH; Resistance: 2kR
LS1 = CMP-00027-00003-1: Audio Indicator 12V 12mA 110dBA 3.5KHz Resonant Frequency Thru-Hole
Q3 = CMP-35916-000009-1: MOSFET 2N-CH 60V 0.3A; Input Capacitance: 40pF; Continuous Drain Current (ID): 300mA; Max Power Dissipation: 285mW; FET Type: 2 N-Channel; Rds On Max: 1.5R; Mount: Surface Mount; Drain to Source Voltage (Vdss): 60V; Packaging: Tape and Reel
Q12 Q13 Q15 = CMP-1259-00116-1: Dual P-Channel Trench MOSFET, -50 V, -0.16 A, -55 to 150 degC, 6-Pin SOT363, Tape and Reel; Manufacturer: NXP Semiconductors; VGSth [typ] (V): -1.6; Automotive Qualified: Y; Channel Type: P; IDM [max] (A): -0.64; Packing: Tape & Reel; Mounting Technology: Surface Mount; PackageDescription: 6-Pin Small Outline Transistor Package, Body 2 x 1.25 mm, Pitch 0.65 mm; ComponentLink2URL: http://www.nxp.com/documents/data_sheet/BSS84AKS.pdf; ComponentLink3URL: http://www.nxp.com/documents/outline_drawing/sot363_po.pdf; PartNumber: BSS84AKS,115; PackageReference: SOT363; PackageVersion: 06-03-16, 03/2006; ComponentLink3Description: Package Specification; ComponentLink2Description: Datasheet; ComponentLink1Description: Manufacturer URL; VDS [max] (V): -50; Code_JEITA: SC-88; ID [max] (A): -0.16; DatasheetVersion: Rev. 1; ComponentLink1URL: http://www.nxp.com/
Q14 = CMP-2000-05968-1: N-Channel Enhancement Mode Mosfet, 50 V, 200 mA, -55 to 150 degC, 6-Pin SOT-323, RoHS, Tape and Reel; Typical Turn-Off Delay Time: 20ns; Number of Channels: 1Channel; Type: EnhancementModeFieldEffectTransistor; Brand: DiodesIncorporated; Vds - Drain-Source Breakdown Voltage: 75V; Vgs - Gate-Source Voltage: 20V; Rds On - Drain-Source Resistance: 1.4Ohms; Transistor Type: 1N-Channel; Configuration: Single; Unit Weight: 0.000212oz; Pd - Power Dissipation: 200mW; Id - Continuous Drain Current: 200mA; Forward Transconductance - Min: 0.1S; Manufacturer URL: http://www.diodes.com/; Series: BSS138; Package Description: 3-Pin Small Outline Transistor, Body 2 x 1.25 mm, Pitch 0.65 mm; Mounting Technology: SurfaceMount; Product Category: MOSFET; RoHS: True; Maximum Operating Temperature: +150C; Height: 1mm; Length: 2.2mm; Technology: Si; Width: 1.35mm; Datasheet URL: http://www.diodes.com/_files/datasheets/ds30206.pdf; Manufacturer: DiodesIncorporated; Package / Case: SOT-323-3; Typical Turn-On Delay Time: 20ns; Transistor Polarity: N-Channel; Factory Pack Quantity: 3000; Packaging: Reel; Product: MOSFETSmallSignal; Datasheet Version: Rev. 11-2, 09/2013; Package Reference: SOT323; Minimum Operating Temperature: -55C; Mounting Style: SMD/SMT; Channel Mode: Enhancement
R4 R7 R23 R25 R30 R31 R34 R35 R37 R40 R42 R43 R47 R48 R82-R84 R88 R90-R93 R95 = CMP-1012-00623-3: Chip Resistor, 10 KOhm, +/- 1%, 0.1 W, -55 to 155 degC, 0603 (1608 Metric), RoHS, Tape and Reel; Manufacturer: Panasonic; Voltage Rating: 75V; Case\/Package: 0603; Power Rating: 100mW; Resistance: 10KOhm; Temperature Coefficient: 100ppm\/degreesC; Number of Pins: 2; Package Reference: 603; Depth: 0.8mm; Mount: SurfaceMount; Package Description: 2-Pin Surface Mount Device, Body 1.6 x 0.85 mm; Datasheet Version: 02/2017; Length: 1.6mm; Lead Free: LeadFree; Height: 0.45mm; Number of Terminations: 2; Max Power Dissipation: 100mW; Min Operating Temperature: -55degC; Datasheet URL: https://industrial.panasonic.com/cdbs/www-data/pdf/RDA0000/AOA0000C304.pdf; Termination: SMD/SMT; Case Code (Metric): 1608; Case Code (Imperial): 0603; Tolerance: 1%; Max Operating Temperature: 155degC; RoHSCompliant: true; Voltage Rating (DC): 75V; Radiation Hardening: No; Packaging: TapeandReel; Composition: ThickFilm; Mounting Technology: SurfaceMount; Manufacturer URL: http://www.panasonic.com/; Width: 0.031inch; REACH SVHC: NoSVHC; Contact Plating: Tin; Military Standard: Not; Package Quantity: 1
R6 R27 R32 R36 R39 R86 R89 R94 R97 = CMP-2000-00180-1: Manufacturer: Panasonic; Part Number: ERJ-3EKF1001V
R8 R24 R33 R38 R41 R49 R85 R87 R96 R98 = CMP-2000-00572-1: Manufacturer: Panasonic; Part Number: ERJ3EKF56R0V
R21 R22 = CMP-009-00206-2: READ THE NAME
R26 R29 = CMP-1012-00372-3: RES SMD 60.4 OHM 1% 1/10W 0603; Resistance: 60.4R; Voltage Rating (DC): 50V; Voltage Rating: 75V; Temperature Coefficient: 100ppm/°C; Power Rating: 100mW; Mount: Surface Mount; Number of Terminations: 2; Max Operating Temperature: 155°C; Case Code (Metric): 1608; Height: 0.022inch; Case/Package: 0603; Min Operating Temperature: -55°C; REACH SVHC: No SVHC; Series: ERJ; Features: Automotive AEC-Q200; Military Standard: Not; Lead Free: Lead Free; Width: 0.031inch; Case Code (Imperial): 0603; Resistance Tolerance: 1%; Packaging: Tape and Reel; Termination: SMD/SMT; Tolerance: 1%; Contact Plating: Tin; Depth: 0.8mm; Resistor Type: Thick Film; Construction: Rectangular; RoHS Compliant: Yes; Max Power Dissipation: 100mW; Package Quantity: 1; Length: 1.6mm
R28 = CMP-2000-00213-2: Chip Resistor, 120 Ohm, +/- 1%, 0.1 W, -55 to 155 degC, 0603 (1608 Metric), RoHS, Tape and Reel; Manufacturer: Panasonic; Power Rating: 100mW; Voltage Rating (DC): 75V; Resistance: 120Ohm; Temperature Coefficient: 100ppm/degreesC; Number of Terminations: 2; Military Standard: Not; Tolerance: 1%; Min Operating Temperature: -55degC; Packaging: TapeandReel; Lead Free: LeadFree; Max Operating Temperature: 155degC; Manufacturer URL: http://www.panasonic.com/; Case Code (Imperial): 0603; REACH SVHC: NoSVHC; Width: 0.031inch; Datasheet URL: https://industrial.panasonic.com/cdbs/www-data/pdf/RDA0000/AOA0000C283.pdf; RoHSCompliant: true; Max Power Dissipation: 100mW; Termination: SMD/SMT; Package Reference: 0603; Height: 0.022inch; Depth: 0.8mm; Package Description: 2-Pin Surface Mount Device, Body 1.6 x 0.85 mm; Contact Plating: Tin; Length: 1.6mm; Package URL: http://www.st.com/st-web-ui/static/active/en/resource/technical/document/datasheet/CD00001320.pdf; Radiation Hardening: No; Package Quantity: 1; Number of Pins: 2; Datasheet Version: 42095.0; Voltage Rating: 75V; Composition: ThickFilm; Case/Package: 0603; Mount: SurfaceMount; Case Code (Metric): 1608
R44-R46 = CMP-2000-00435-2: Chip Resistor, 330 Ohm, +/- 1%, 0.1 W, -55 to 155 degC, 0603 (1608 Metric), RoHS, Tape and Reel; Gender: Male; Mating Cycles: 10000; Current Rating: 500 mA; Voltage Rating: 10 V; REACH SVHC: No SVHC; PackageDescription: 2-Pin Surface Mount Device, Body 1.6 x 0.85 mm; Contact Finish: Gold; Pins: 8; ComponentLink1Description: Manufacturer URL; Packaging: Tape and Reel; Max Operating Temperature: 85 degC; Contact Material: Copper; Height: 1.45 mm; Width: 1.45 mm; DatasheetVersion: Apr-15; Package Quantity: 1500; Contact Plating: Gold; PackageReference: 0603; Mount: Surface Mount; Lead Pitch: 1.1 mm; Min Operating Temperature: -25 degC; ComponentLink1URL: http://www.panasonic.com/; ComponentLink2URL: http://industrial.panasonic.com/cdbs/www-data/pdf/RDA0000/AOA0000C86.pdf; Length: 13.7 mm; ComponentLink2Description: Datasheet; RoHSCompliant: true
SW1-SW3 = CMP-10040-000029-1: SWITCH TACTILE SPST-NO 0.02A 15V; Operating Force: 240gf; Switch Travel: 0.13mm; Illumination Type: Non-Illuminated; Throw Configuration: SPST; Number of Ports: 1; Current Rating: 5A; Mechanical Life: 500000Cycles; Switch Function: Off-Mom; Connector Type: USB; Actuator Type: Standard; Gender: Receptacle; Number of Contacts: 24; Contact Plating: Gold; Insulation Color: Black; Min Operating Temperature: -40°C; Packaging: Tape and Reel; Flammability Rating: UL94 V-0; Max Operating Temperature: 85°C; Termination: Solder; Mount: Surface Mount
TP3 TP8 = CMP-00028-00002-2: 0.6mm round; Pins: 1
U1 = CMP-014-00004-1: LM2902 Series 30 V 1.3 MHz Low-Power Quad Operational Amplifier - QFN-16 (3x3)
U4 = CMP-12105-000107-1: IC MCU 32BIT 128KB FLASH 100LQFP
U5 = CMP-0054-00372-2: 8-Channel, 50 kSPS to 200 kSPS, 8-Bit A/D Converter, 16-pin TSSOP, Pb-Free; Manufacturer: National Semiconductor; PackageTopMarking: NSUZXYTT*88S022*CIMT; CompType: ADC IC; PowerWise: Y; ComponentLink2URL: http://www.national.com/pf/AD/ADC088S022.html; RoHS: Y; PackageDescription: Molded TSSOP, Jedec, 5 x 4.4 x 0.9mm Body, 16 Lead, 0.65mm Pitch; DatasheetVersion: Feb-2010; PinCount: 16; ComponentLink1Description: ADC088S022 Datasheet; Code_JEDEC: MO-153-AB; ComponentLink3URL: http://www.national.com/packaging/folders/mtc16.html; PackageVersion: revD, Jun-2003; ComponentLink3Description: MTC16 Package Page; RevisionNote: Component URLs added; ComponentLink1URL: http://www.national.com/ds/AD/ADC088S022.pdf; ComponentLink2Description: ADC088S022 Web Page; PackageReference: MTC16
U6 = CMP-015-00012-2: Automotive CAN FD transceiver with watchdog, bus diagnostics and partial networking via sele 14-SOT-23-THIN -40 to 150
U7 = CMP-12756-000009-1: IC REG LINEAR 5V 150MA SOT89; Manufacturer: Diodes Inc.; Output Type: Fixed; Min Supply Voltage: 3.3V; Max Junction Temp: +125°C; Max Supply Voltage: 40V; Nominal Supply Current: 2.5-25uA; Number Of Outputs: 1; Dropout Voltage: 1000mV; Manufacturer Part Number: AP7381-50Y-13; RoHS: TRUE; Digikey Description: IC REG LINEAR 5V 150MA SOT89; Output Voltage: 5V; Footprint Url: https://www.diodes.com/assets/Package-Files/SOT89.pdf; Category: IC; Temperature: -40°C to +125°C; ComponentLink2Description: Datasheet; Package: SOT89; Temperature Range Low: -40°C; Temperature Range High: +125°C; ComponentLink2URL: https://www.diodes.com/assets/Datasheets/AP7381.pdf; Device Class L1: Integrated Circuits (ICs); Automotive: No; Output Current: 150mA; Ambient Temperature Range High: +85°C; Octopart: https://octopart.com/ap7381-50y-13-diodes+inc.-87775116; Lead Free: Yes; Device Class L2: Power Management ICs; Height: 1.6mm; Device Class L3: Voltage Regulators - Linear; Ambient Temperature Range Low: -40°C
Y1 = CMP-27762-011708-1: Crystal 48MHz ±20ppm 18pF SMD-4 3.2mm x 2.5mm; Series Resistance: 35R; Frequency Stability: 50ppm; Package Quantity: 1000; Packaging: Tape and Reel; Mount: Surface Mount; Length: 3.2mm; Load Capacitance: 18pF; Max Operating Temperature: 70°C; Operating Frequency: 48 MHz; RoHS Compliant: Yes; Series: ABM8; Frequency Tolerance: 20ppm; Lead Free: Lead Free; Min Operating Temperature: -20°C; Case/Package: CSMD; Number of Pins: 4; Height: 0.031inch; ESR (Equivalent Series Resistance): 35R; Frequency: 48MHz; Radiation Hardening: No; Width: 0.098inch; Tolerance: 20ppm; Termination: SMD/SMT; Depth: 2.5mm; Resistor Type: Ceramic; REACH SVHC: No SVHC
Y2 = CMP-40224-000006-1: CRYSTAL 32.7680KHZ 12.5PF SMD; Manufacturer: ECS International; Frequency: 32.768kHz; Esr: 90kΩ; Tolerance: 20ppm; Device Class L1: Passive Components; Load Capacitance: 12.5pF; Temperature: -40°C to +85°C; ComponentLink2URL: https://ecsxtal.com/store/pdf/ECX-1210.pdf; Series: ECX-1210; Octopart: https://octopart.com/ecs-.327-12.5-1210-tr-ecs+international-81221340; ComponentLink2Description: Datasheet; Temperature Range Low: -40°C; Digikey Description: CRYSTAL 32.7680KHZ 12.5PF SMD; Lead Free: Yes; RoHS: TRUE; Device Class L3: Crystals; Automotive: No; Category: Crys; Height: 0.5mm; Manufacturer Part Number: ECS-.327-12.5-1210-TR; Temperature Range High: +85°C; Device Class L2: Crystals / Oscillators; Package: ECX-1210